# Altium schematic sheet External Connectors.SchDoc
size A4
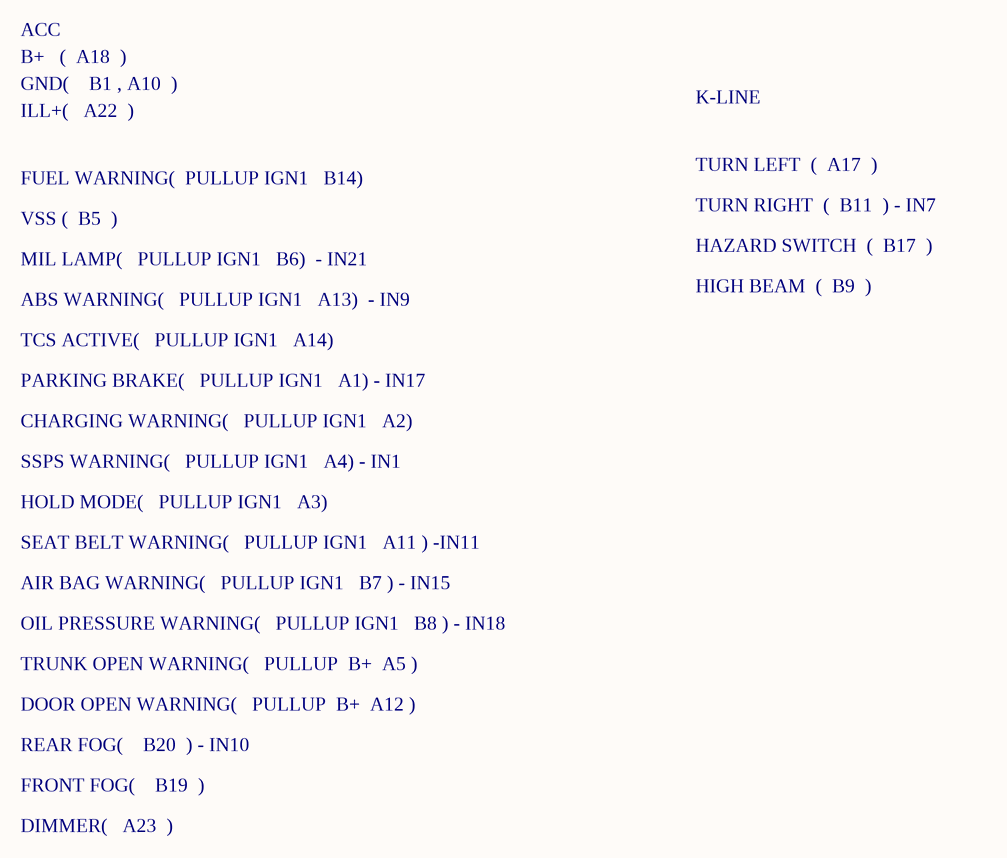
[diagram p0: External Connectors.SchDoc]

## Notes on the sheet
- B+   (  A18  )
- GND(    B1 , A10  )
- ACC
- ILL+(   A22  )
- K-LINE
- FUEL WARNING(  PULLUP IGN1   B14)
- VSS (  B5  )
- TURN LEFT  (  A17  )
- TURN RIGHT  (  B11  ) - IN7
- MIL LAMP(   PULLUP IGN1   B6)  - IN21
- HAZARD SWITCH  (  B17  )
- HIGH BEAM  (  B9  )
- ABS WARNING(   PULLUP IGN1   A13)  - IN9
- TCS ACTIVE(   PULLUP IGN1   A14)
- PARKING BRAKE(   PULLUP IGN1   A1) - IN17
- CHARGING WARNING(   PULLUP IGN1   A2)
- SSPS WARNING(   PULLUP IGN1   A4) - IN1
- HOLD MODE(   PULLUP IGN1   A3)
- SEAT BELT WARNING(   PULLUP IGN1   A11 ) -IN11
- AIR BAG WARNING(   PULLUP IGN1   B7 ) - IN15
- OIL PRESSURE WARNING(   PULLUP IGN1   B8 ) - IN18
- TRUNK OPEN WARNING(   PULLUP  B+  A5 )
- DOOR OPEN WARNING(   PULLUP  B+  A12 )
- REAR FOG(    B20  ) - IN10
- FRONT FOG(    B19  )
- DIMMER(   A23  )